# EAGLE design QuadControl2_itg-3200_2 (EAGLE 5.11)
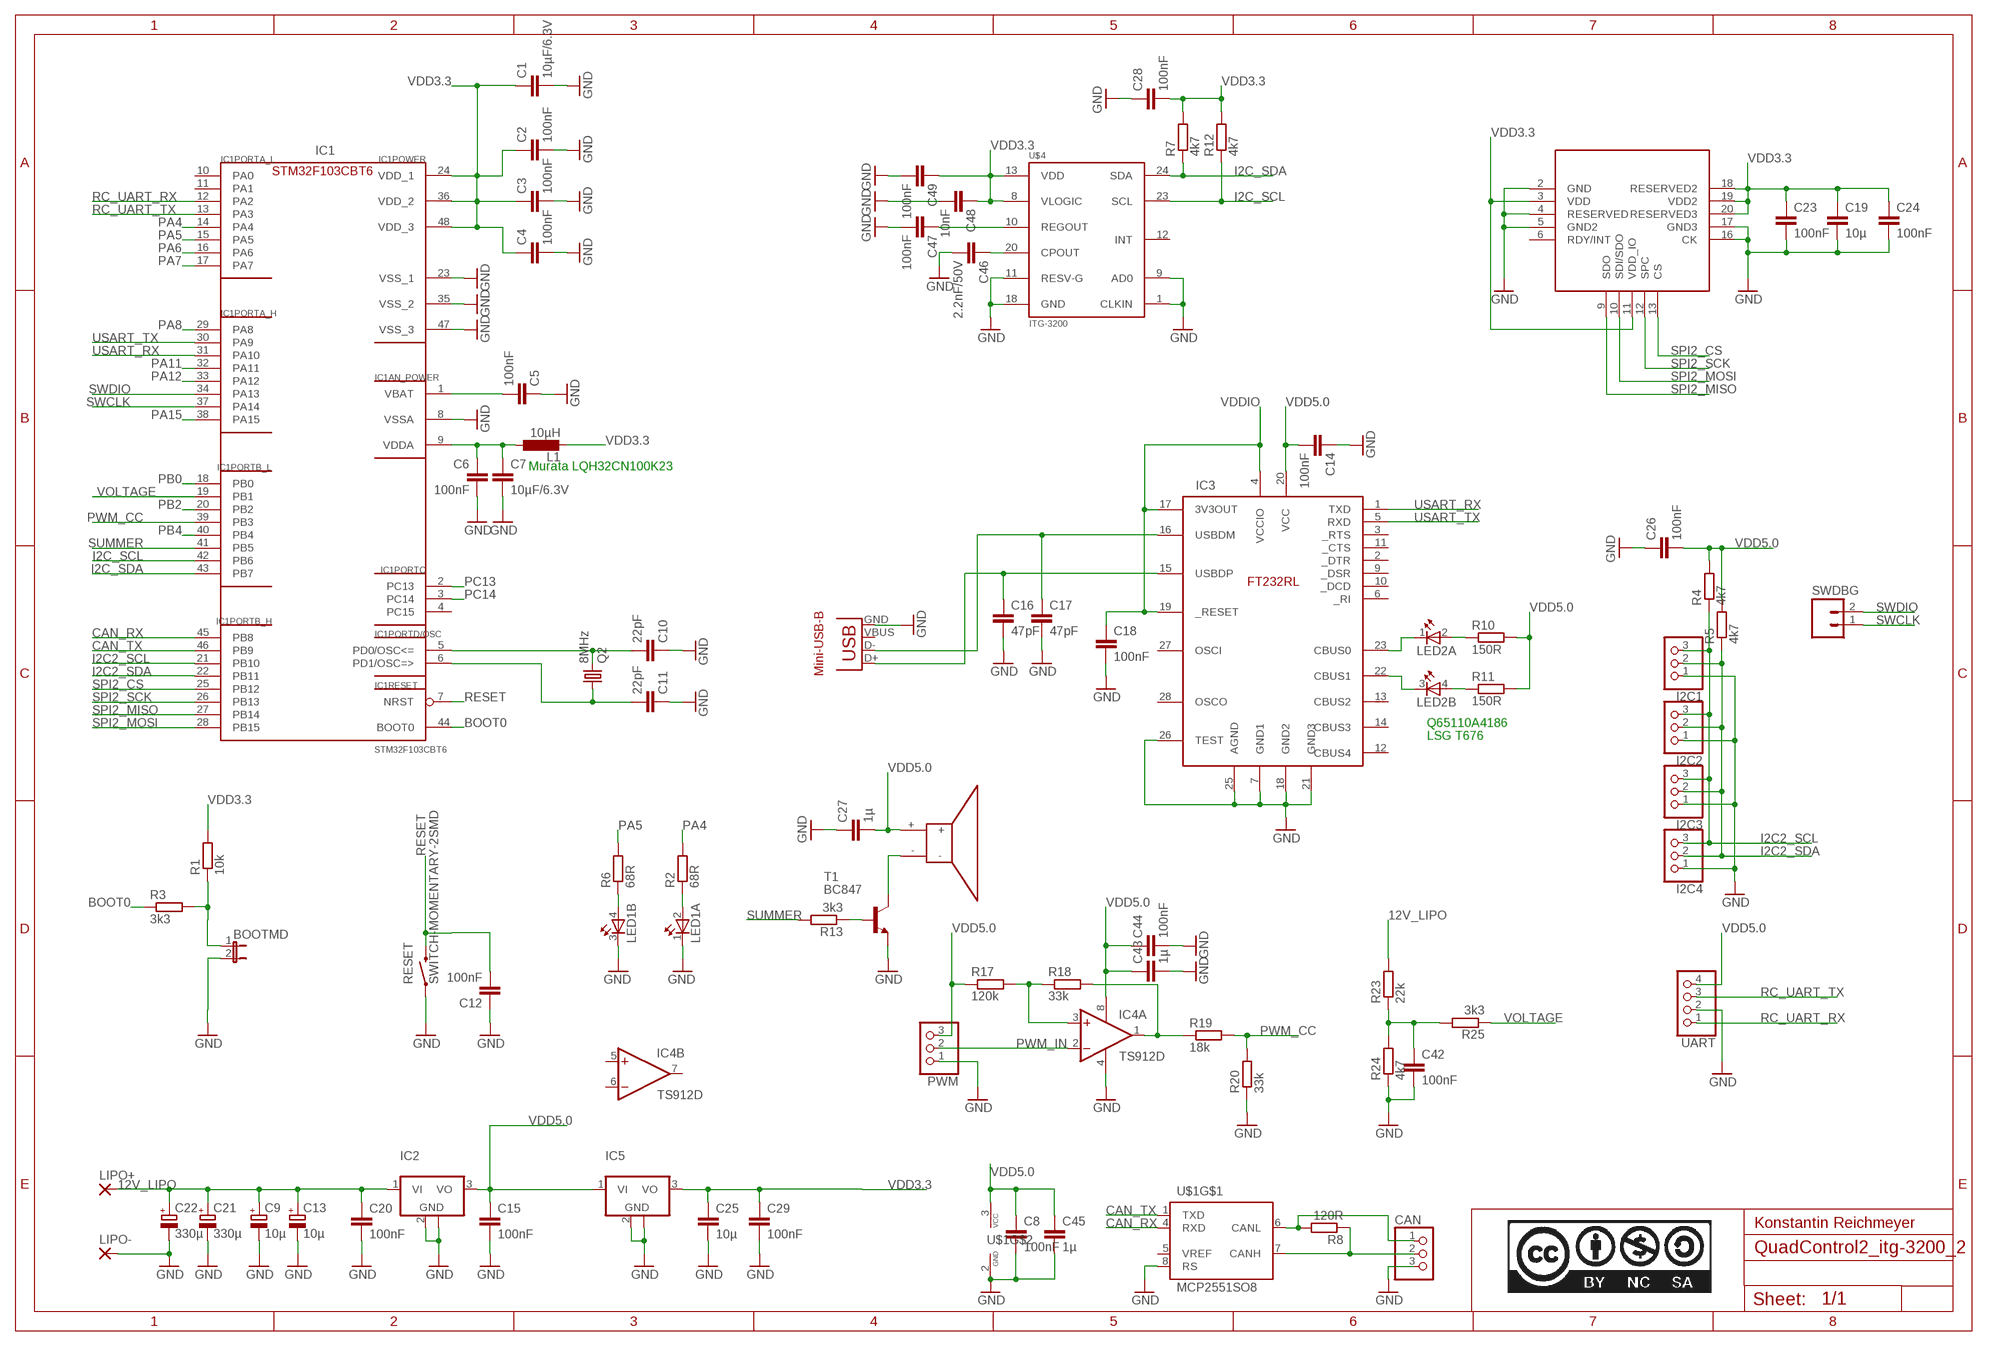
[diagram p0: schematic, sheet 1]

## Parts
BOOTMD  JUMPER-2PTH  [1X02]
C1  10µF/6.3V  C-EUC0805  [C0805]
C2  100nF  C-EUC0805  [C0805]
C3  100nF  C-EUC0805  [C0805]
C4  100nF  C-EUC0805  [C0805]
C5  100nF  C-EUC0805  [C0805]
C6  100nF  C-EUC0805  [C0805]
C7  10µF/6.3V  C-EUC0805  [C0805]
C8  100nF  C-EUC0805  [C0805]
C9  10µ  CPOL-EUD/7343-31R  [D/7343-31R]
C10  22pF  C-EUC0805  [C0805]
C11  22pF  C-EUC0805  [C0805]
C12  100nF  C-EUC0805  [C0805]
C13  10µ  CPOL-EUD/7343-31R  [D/7343-31R]
C14  100nF  C-EUC0805  [C0805]
C15  100nF  C-EUC0805  [C0805]
C16  47pF  C-EUC0805  [C0805]
C17  47pF  C-EUC0805  [C0805]
C18  100nF  C-EUC0805  [C0805]
C19  10µ  C-EUC0805  [C0805]
C20  100nF  C-EUC0805  [C0805]
C21  330µ  CPOL-EUF  [PANASONIC_F]
C22  330µ  CPOL-EUF  [PANASONIC_F]
C23  100nF  C-EUC0805  [C0805]
C24  100nF  C-EUC0805  [C0805]
C25  10µ  C-EUC0805  [C0805]
C26  100nF  C-EUC0805  [C0805]
C27  1µ  C-EUC0805  [C0805]
C28  100nF  C-EUC0805  [C0805]
C29  100nF  C-EUC0805  [C0805]
C42  100nF  C-EUC0805  [C0805]
C43  1µ  C-EUC0805  [C0805]
C44  100nF  C-EUC0805  [C0805]
C45  1µ  C-EUC0805  [C0805]
C46  2.2nF/50V  C-EUC0805  [C0805]
C47  100nF  C-EUC0805  [C0805]
C48  10nF  C-EUC0805  [C0805]
C49  100nF  C-EUC0805  [C0805]
CAN  PINHD-1X3  [1X03]
I2C1  PINHD-1X3  [1X03]
I2C2  PINHD-1X3  [1X03]
I2C3  PINHD-1X3  [1X03]
I2C4  PINHD-1X3  [1X03]
IC1  STM32F103CBT6  STM32F10XCXT6  [TQFP48]
IC2  UA78M05DCY  [SOT223]
IC3  FT232RL  [SSOP28DB]
IC4  TS912D  [SO08]
IC5  UA78M05DCY  [SOT223]
L1  10µH  L-EUL1210  [R1210]
LED1  TOPLED-2-MPI  [P-LCC-4-2-MPI]
LED2  TOPLED-2-MPI  [P-LCC-4-2-MPI]
LIPO+  WIREPAD3,17/1,3  [3,17/1,3]
LIPO-  WIREPAD3,17/1,3  [3,17/1,3]
PWM  PINHD-1X3  [1X03]
Q2  8MHz  CRYSTALSM49  [SM49]
R1  10k  R-EU_R0805  [R0805]
R2  68R  R-EU_R0805  [R0805]
R3  3k3  R-EU_R0805  [R0805]
R4  4k7  R-EU_R0805  [R0805]
R5  4k7  R-EU_R0805  [R0805]
R6  68R  R-EU_R0805  [R0805]
R7  4k7  R-EU_R0805  [R0805]
R8  120R  R-EU_R0805  [R0805]
R10  150R  R-EU_R0805  [R0805]
R11  150R  R-EU_R0805  [R0805]
R12  4k7  R-EU_R0805  [R0805]
R13  3k3  R-EU_R0805  [R0805]
R17  120k  R-EU_R0805  [R0805]
R18  33k  R-EU_R0805  [R0805]
R19  18k  R-EU_R0805  [R0805]
R20  33k  R-EU_R0805  [R0805]
R23  22k  R-EU_R0805  [R0805]
R24  4k7  R-EU_R0805  [R0805]
R25  3k3  R-EU_R0805  [R0805]
RESET  SWITCH-MOMENTARY-2SMD  [TACTILE_SWITCH_SMD]
SWDBG  M02PTH  [1X02]
T1  BC847  [SOT23]
U$1  MCP2551SO8  [SO08]
U$2  AIS325DQ_DEVICEHANDSOLDER  [QFN-28]
U$3  SUMMER_DIV  [SUMMER_FOOTPRINT]
U$4  ITG-3200  [QFN-24HANDSOLDER]
UART  PINHD-1X4  [1X04]
USB2  USB-MB-S2  [USB-MP-S2]

## Nets
12V_LIPO: C9.+ C13.+ C20.1 C21.+ C22.+ IC2.1(VI) LIPO+.1(P) R23.2
3243: T1.3(C) U$3.-
BOOT0: IC1.44(RESET:BOOT0) R3.1
CAN_RX: IC1.45(PORTB_H:PB8) U$1.4(RXD)
CAN_TX: IC1.46(PORTB_H:PB9) U$1.1(TXD)
D+: C16.1 IC3.15(USBDP) USB2.D+
D-: C17.1 IC3.16(USBDM) USB2.D-
GND: BOOTMD.2 C1.2 C2.2 C3.2 C4.2 C5.1 C6.2 C7.2 C8.2 C9.- C10.1 C11.1 C12.1 C13.- C14.1 C15.2 C16.2 C17.2 C18.2 C19.2 C20.2 C21.- C22.- C23.2 C24.2 C25.2 C26.1 C27.1 C28.1 C29.2 C42.2 C43.2 C44.2 C45.2 C46.2 C47.2 C48.2 C49.2 CAN.3 I2C1.1 I2C2.1 I2C3.1 I2C4.1 IC1.8(AN_POWER:VSSA) IC1.23(POWER:VSS_1) IC1.35(POWER:VSS_2) IC1.47(POWER:VSS_3) IC2.2(GND) IC2.4(GND) IC3.7(GND1) IC3.18(GND2) IC3.21(GND3) IC3.25(AGND) IC3.26(TEST) IC4.4(GND) IC5.2(GND) IC5.4(GND) LED1.1(A:C) LED1.3(B:C) LIPO-.1(P) PWM.1 R20.1 R24.1 RESET.1 T1.2(E) U$1.2(GND) U$1.8(RS) U$2.2(GND) U$2.4(RESERVED) U$2.5(GND2) U$2.16(CK) U$2.17(GND3) U$4.1(CLKIN) U$4.9(AD0) U$4.11(RESV-G) U$4.18(GND) UART.2 USB2.GND
I2C2_SCL: I2C1.3 I2C2.3 I2C3.3 I2C4.3 IC1.21(PORTB_H:PB10) R4.1
I2C2_SDA: I2C1.2 I2C2.2 I2C3.2 I2C4.2 IC1.22(PORTB_H:PB11) R5.1
I2C_SCL: IC1.42(PORTB_L:PB6) R12.1 U$4.23(SCL)
I2C_SDA: IC1.43(PORTB_L:PB7) R7.1 U$4.24(SDA)
N$1: CAN.1 R8.2 U$1.6(CANL)
N$2: IC3.23(CBUS0) LED2.1(A:C)
N$3: IC3.22(CBUS1) LED2.3(B:C)
N$4: LED2.2(A:A) R10.1
N$5: LED2.4(B:A) R11.1
N$6: C46.1 U$4.20(CPOUT)
N$7: CAN.2 R8.1 U$1.7(CANH)
N$8: LED1.2(A:A) R2.1
N$9: LED1.4(B:A) R6.1
N$10: BOOTMD.1 R1.1 R3.2
N$12: R13.1 T1.1(B)
N$13: C47.1 U$4.10(REGOUT)
N$18: C10.2 IC1.5(PORTD/OSC:PD0/OSC<=) Q2.2
N$19: C11.2 IC1.6(PORTD/OSC:PD1/OSC=>) Q2.1
N$22: C42.1 R23.1 R24.2 R25.2
N$24: IC4.3(A:+IN) R17.2 R18.1
N$25: IC4.1(A:OUT) R18.2 R19.1
PA4: IC1.14(PORTA_L:PA4) R2.2
PA5: IC1.15(PORTA_L:PA5) R6.2
PA6: IC1.16(PORTA_L:PA6)
PA7: IC1.17(PORTA_L:PA7)
PA8: IC1.29(PORTA_H:PA8)
PA11: IC1.32(PORTA_H:PA11)
PA12: IC1.33(PORTA_H:PA12)
PA15: IC1.38(PORTA_H:PA15)
PB0: IC1.18(PORTB_L:PB0)
PB2: IC1.20(PORTB_L:PB2)
PB4: IC1.40(PORTB_L:PB4)
PC13: IC1.2(PORTC:PC13)
PC14: IC1.3(PORTC:PC14)
PWM_CC: IC1.39(PORTB_L:PB3) R19.2 R20.2
PWM_IN: IC4.2(A:-IN) PWM.2
RC_UART_RX: IC1.12(PORTA_L:PA2) UART.1
RC_UART_TX: IC1.13(PORTA_L:PA3) UART.3
RESET: C12.2 IC1.7(RESET:NRST) RESET.3
SPI2_CS: IC1.25(PORTB_H:PB12) U$2.13(CS)
SPI2_MISO: IC1.27(PORTB_H:PB14) U$2.9(SDO)
SPI2_MOSI: IC1.28(PORTB_H:PB15) U$2.10(SDI/SDO)
SPI2_SCK: IC1.26(PORTB_H:PB13) U$2.12(SPC)
SUMMER: IC1.41(PORTB_L:PB5) R13.2
SWCLK: IC1.37(PORTA_H:PA14) SWDBG.1
SWDIO: IC1.34(PORTA_H:PA13) SWDBG.2
USART_RX: IC1.31(PORTA_H:PA10) IC3.1(TXD)
USART_TX: IC1.30(PORTA_H:PA9) IC3.5(RXD)
VBAT: C5.2 IC1.1(AN_POWER:VBAT)
VDD3.3: C1.1 C2.1 C3.1 C4.1 C19.1 C23.1 C24.1 C25.1 C28.2 C29.1 C48.1 C49.1 IC1.24(POWER:VDD_1) IC1.36(POWER:VDD_2) IC1.48(POWER:VDD_3) IC5.3(VO) L1.2 R1.2 R7.2 R12.2 U$2.3(VDD) U$2.11(VDD_IO) U$2.18(RESERVED2) U$2.19(VDD2) U$2.20(RESERVED3) U$4.8(VLOGIC) U$4.13(VDD)
VDD5.0: C8.1 C14.2 C15.1 C26.2 C27.2 C43.1 C44.1 C45.1 IC2.3(VO) IC3.20(VCC) IC4.8(+5V) IC5.1(VI) PWM.3 R4.2 R5.2 R10.2 R11.2 R17.1 U$1.3(VCC) U$3.+ UART.4
VDDA: C6.1 C7.1 IC1.9(AN_POWER:VDDA) L1.1
VDDIO: C18.1 IC3.4(VCCIO) IC3.17(3V3OUT) IC3.19(_RESET)
VOLTAGE: IC1.19(PORTB_L:PB1) R25.1
Unconnected: IC1.4(PORTC:PC15) IC1.10(PORTA_L:PA0) IC1.11(PORTA_L:PA1) IC3.2(_DTR) IC3.3(_RTS) IC3.6(_RI) IC3.9(_DSR) IC3.10(_DCD) IC3.11(_CTS) IC3.12(CBUS4) IC3.13(CBUS2) IC3.14(CBUS3) IC3.27(OSCI) IC3.28(OSCO) IC4.5(B:+IN) IC4.6(B:-IN) IC4.7(B:OUT) U$1.5(VREF) U$2.6(RDY/INT) U$4.12(INT) USB2.VBUS

## Notes on the sheet
- IC1
- STM32F103CBT6
- Murata LQH32CN100K23
- FT232RL
- Mini-USB-B
- Q65110A4186
- LSG T676
- Konstantin Reichmeyer

## Library data of the parts
BOOTMD = SparkFun:JUMPER-2: Jumper Basic 0.1" spaced jumper. Use with breakaway headers.
C1-C8 C10-C12 C14-C20 C23-C29 C42-C49 = rcl:C-EU: CAPACITOR, European symbol
C9 C13 C21 C22 = rcl:CPOL-EU: POLARIZED CAPACITOR, European symbol
CAN I2C1-I2C4 PWM = pinhead:PINHD-1X3: PIN HEADER
IC1 = stm32:STM32F10XCXT6: ST STM32F101/103 48pin LQFP
IC2 IC5 = linear:UA78M*: POSITIVE-VOLTAGE REGULATORS Source: http://focus.ti.com/lit/ds/symlink/ua78m33.pdf
IC3 = ftdichip:FT232RL: USB UART 4th Generation USB UART (USB <-> Serial) Controller
IC4 = ts912:TS912: OP AMP TS912 Rail-to-Rail OP AMP Source: http://www.st.com/stonline/products/literature/ds/2325/ts912.pdf
L1 = rcl:L-EU: INDUCTOR, European symbol
LED1 LED2 = led:TOPLED-2-: Multi TOPLED® (two color) LG T672, LP T672 LSY T67B LSW T67C LSY T675 LSY T676 LSG T677 LSG T770 Source: http://www.osram.convergy.de/
LIPO+ LIPO- = wirepad:WIREPAD: Wire PAD connect wire on PCB
Q2 = crystal:CRYSTAL: CRYSTAL
R1-R8 R10-R13 R17-R20 R23-R25 = rcl:R-EU_: RESISTOR, European symbol
RESET = SparkFun:SWITCH-MOMENTARY-2
SWDBG = SparkFun:M02: Header 2 Standard 2-pin 0.1" header. Use with straight break away headers (SKU : PRT-00116), right angle break away headers (PRT-00553), swiss pins (PRT-00743), machine pins (PRT-00117), and female headers (PRT-00115). Molex polarized connector foot print use with SKU : PRT-08233 with associated crimp pins and housings.
T1 = transistor:BC847: NPN TRANSISTOR
U$1 = can:MCP2551: CAN Tranceiver Microchip
U$2 = ais326dq:AIS325DQ_DEVICE
U$3 = summer:SUMMER_DIV
U$4 = SparkFun:ITG-3200: ITG-3200 3-axis gyro, digital output, qfn24 package
UART = pinhead:PINHD-1X4: PIN HEADER
USB2 = con-usb:USB: USB Connectors

## Board
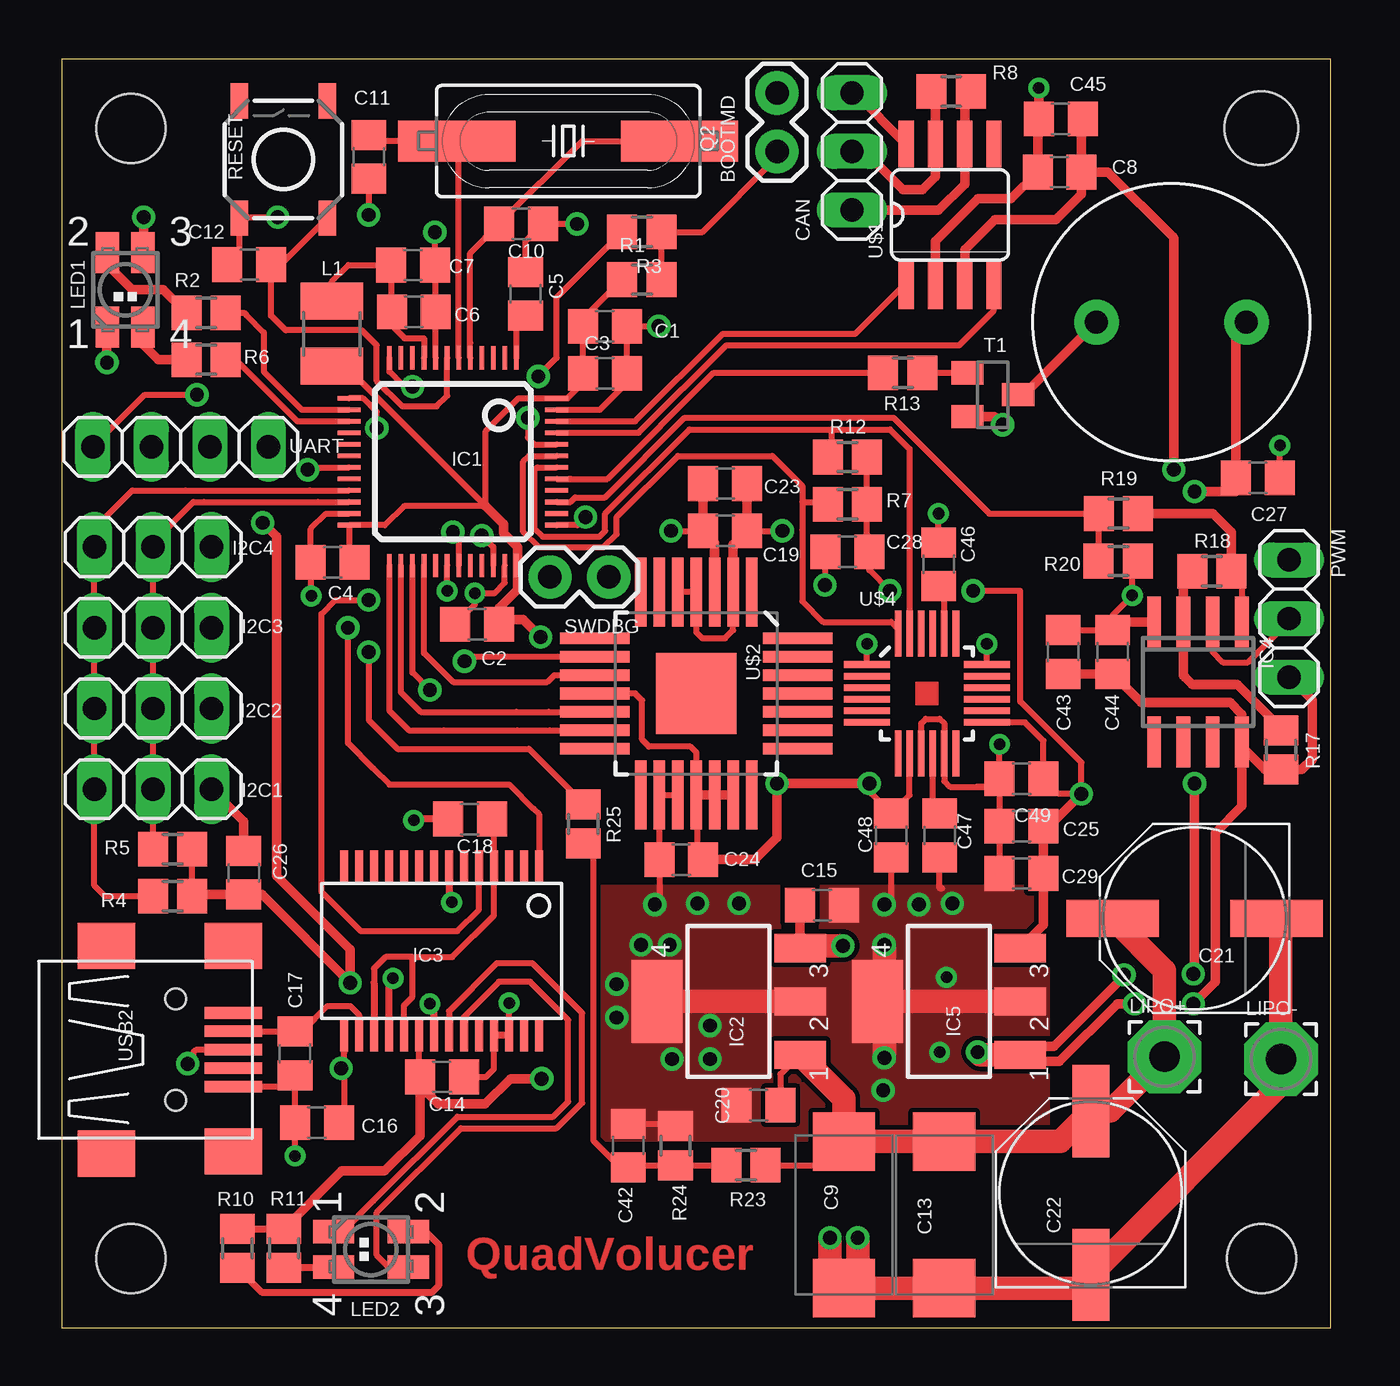
[diagram p1: board, top side]
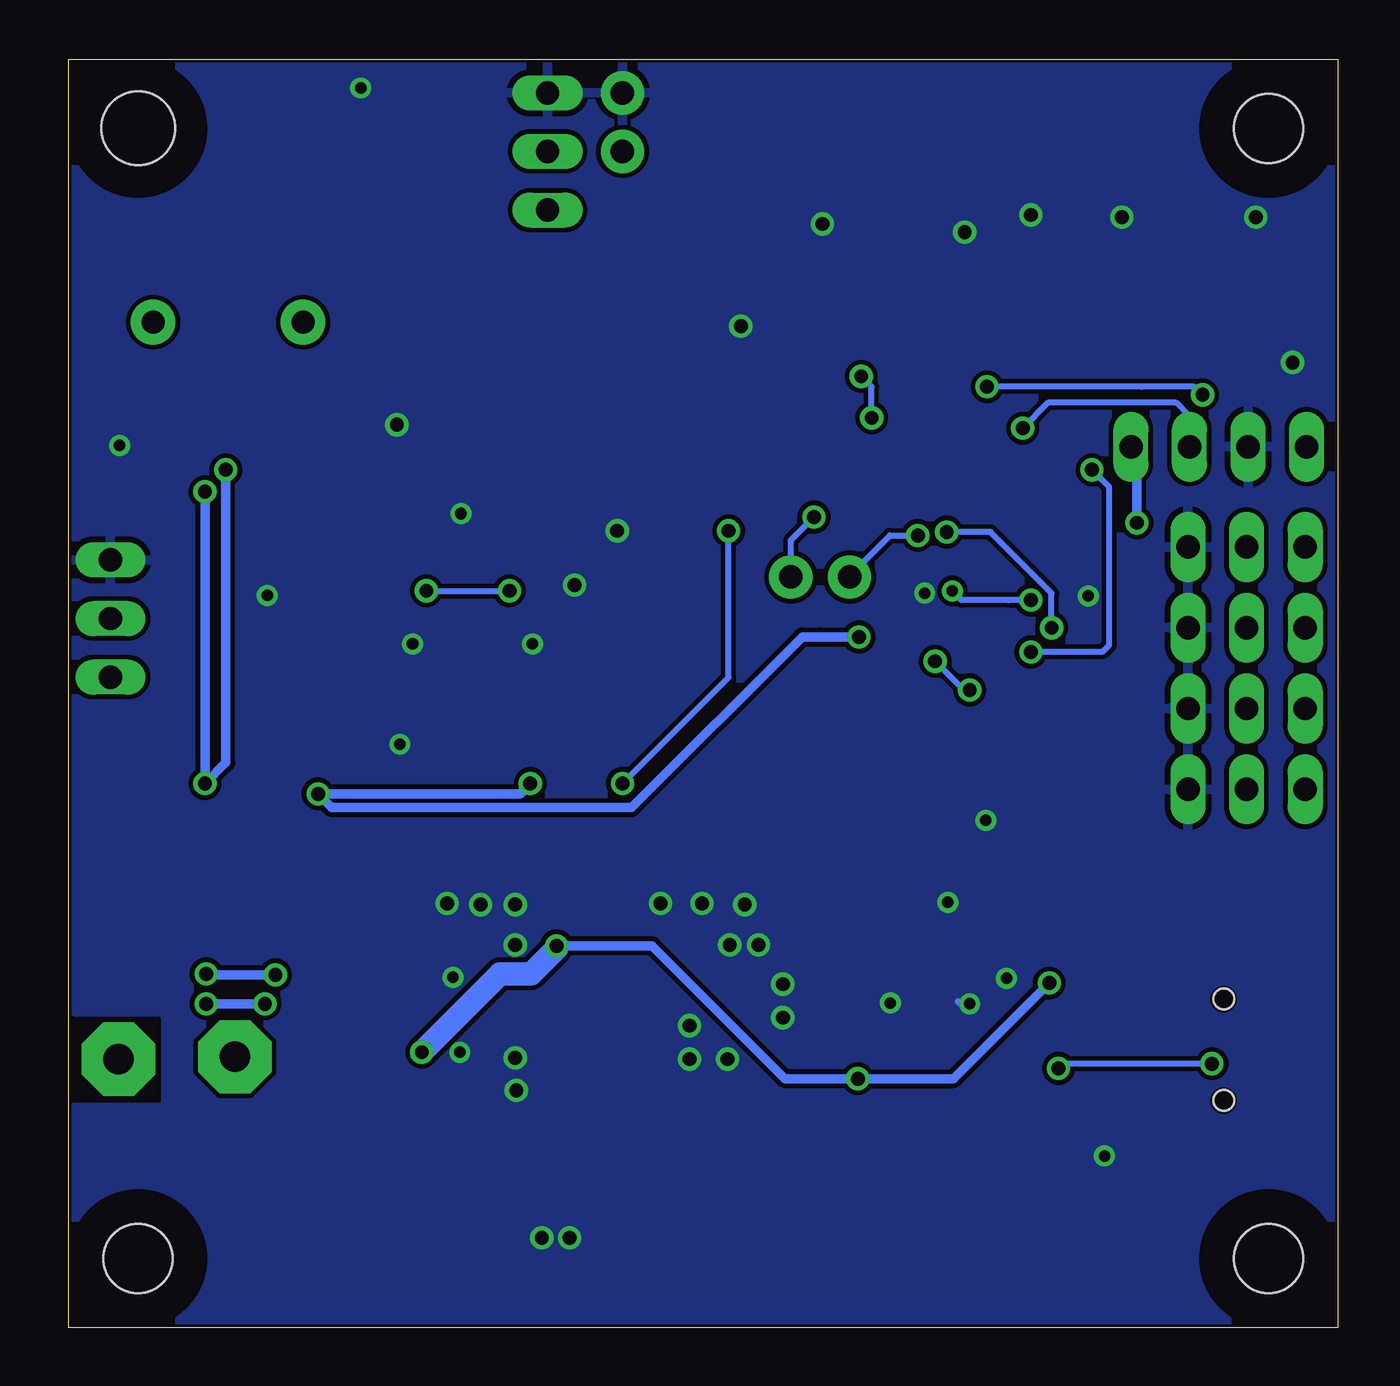
[diagram p2: board, bottom side, seen from below]

Size 55 x 55 mm. Coordinates in mm from the lower left corner, seen from the top.
Outline: 55,0 55,55 0,55 0,0 55,0
Copper layers (1*16): Top 0.035mm / dielectric 1.5mm / Bottom 0.035mm
Design rules: minimum track width 5mil, minimum drill 10mil, track to track 8mil, track to pad 8mil, pad to pad 8mil, via to via 8mil, smd to smd 8mil, copper to edge 5mil, drill to drill 8mil, minimum pad ring 10mil, minimum via ring 8mil, stop-mask expansion 4mil, vias tented up to drill 0mil, thermal gap 10mil
Holes 3 mm at 52,3 3,3 3,52
Holes 3.2 mm at 52,52
tRestrict: area 49,0 to 55,6; area 0,0 to 6,6; area 0,49 to 6,55; area 49,49 to 55,55
bRestrict: area 49,0 to 55,6; area 0,0 to 6,6; area 0,49 to 6,55; area 49,49 to 55,55

### Footprints (pad centres in the part's own frame; a part is rotated, then mirrored left to right if it is on the bottom)
1X02 = drill 1.016 pad 1.88: 1 0,0; 2 2.54,0
C0805 = smd 1.3 x 1.5: 1 -0.95,0; 2 0.95,0
D/7343-31R = smd 2.55 x 2.7: + 3.175,0; - -3.175,0
PANASONIC_F = smd 4 x 1.6: + 3.55,0; - -3.55,0
1X03 = drill 1.016 long: 1 -2.54,0; 2 0,0; 3 2.54,0
TQFP48 = smd 0.2 x 1: 1 -2.75,-4.5; 2 -2.25,-4.5; 3 -1.75,-4.5; 4 -1.25,-4.5; 5 -0.75,-4.5; 6 -0.25,-4.5; 7 0.25,-4.5; 8 0.75,-4.5; 9 1.25,-4.5; 10 1.75,-4.5; 11 2.25,-4.5; 12 2.75,-4.5; 25 2.75,4.5; 26 2.25,4.5; 27 1.75,4.5; 28 1.25,4.5; 29 0.75,4.5; 30 0.25,4.5; 31 -0.25,4.5; 32 -0.75,4.5; 33 -1.25,4.5; 34 -1.75,4.5; 35 -2.25,4.5; 36 -2.75,4.5 | smd 1 x 0.2: 13 4.5,-2.75; 14 4.5,-2.25; 15 4.5,-1.75; 16 4.5,-1.25; 17 4.5,-0.75; 18 4.5,-0.25; 19 4.5,0.25; 20 4.5,0.75; 21 4.5,1.25; 22 4.5,1.75; 23 4.5,2.25; 24 4.5,2.75; 37 -4.5,2.75; 38 -4.5,2.25; 39 -4.5,1.75; 40 -4.5,1.25; 41 -4.5,0.75; 42 -4.5,0.25; 43 -4.5,-0.25; 44 -4.5,-0.75; 45 -4.5,-1.25; 46 -4.5,-1.75; 47 -4.5,-2.25; 48 -4.5,-2.75
SOT223 = smd 1.219 x 2.235: 1 -2.311,-3.099; 2 0,-3.099; 3 2.311,-3.099 | smd 3.6 x 2.2: 4 0,3.099
SSOP28DB = smd 0.348 x 1.397: 1 -4.225,-3.656; 2 -3.575,-3.656; 3 -2.925,-3.656; 4 -2.275,-3.656; 5 -1.625,-3.656; 6 -0.975,-3.656; 7 -0.325,-3.656; 8 0.325,-3.656; 9 0.975,-3.656; 10 1.625,-3.656; 11 2.275,-3.656; 12 2.925,-3.656; 13 3.575,-3.656; 14 4.225,-3.656; 15 4.225,3.656; 16 3.575,3.656; 17 2.925,3.656; 18 2.275,3.656; 19 1.625,3.656; 20 0.975,3.656; 21 0.325,3.656; 22 -0.325,3.656; 23 -0.975,3.656; 24 -1.625,3.656; 25 -2.275,3.656; 26 -2.925,3.656; 27 -3.575,3.656; 28 -4.225,3.656
SO08 = smd 0.6 x 2.2: 1 -1.905,-2.6; 2 -0.635,-2.6; 3 0.635,-2.6; 4 1.905,-2.6; 5 1.905,2.6; 6 0.635,2.6; 7 -0.635,2.6; 8 -1.905,2.6
R1210 = smd 1.6 x 2.7: 1 -1.4,0; 2 1.4,0
P-LCC-4-2-MPI = smd 1.016 x 1.778: 1 -0.77,-1.619; 2 -0.77,1.619; 3 0.77,1.619; 4 0.77,-1.619
3,17/1,3 = drill 1.321 pad 3.175 octagon: 1 0,0
SM49 = smd 5.08 x 1.778: 1 -4.826,0; 2 4.826,0
R0805 = smd 1.3 x 1.5: 1 -0.85,0; 2 0.85,0
TACTILE_SWITCH_SMD = smd 1.524 x 0.762: 1 -2.54,1.905; 2 2.54,1.905; 3 -2.54,-1.905; 4 2.54,-1.905
SOT23 = smd 1 x 1.4: 1 -0.95,-1.1; 2 0.95,-1.1; 3 0,1.1
SO08' = smd 0.66 x 2.032: 1 -1.905,-3.073; 2 -0.635,-3.073; 3 0.635,-3.073; 4 1.905,-3.073; 5 1.905,3.073; 6 0.635,3.073; 7 -0.635,3.073; 8 -1.905,3.073
QFN-28 = smd 3.5 x 3.5: 0 0,0 | smd 3 x 0.5: 1 -4.4,2.4; 2 -4.4,1.6; 3 -4.4,0.8; 4 -4.4,0; 5 -4.4,-0.8; 6 -4.4,-1.6; 7 -4.4,-2.4; 15 4.4,-2.4; 16 4.4,-1.6; 17 4.4,-0.8; 18 4.4,0; 19 4.4,0.8; 20 4.4,1.6; 21 4.4,2.4 | smd 0.5 x 3: 8 -2.4,-4.4; 9 -1.6,-4.4; 10 -0.8,-4.4; 11 0,-4.4; 12 0.8,-4.4; 13 1.6,-4.4; 14 2.4,-4.4; 22 2.4,4.4; 23 1.6,4.4; 24 0.8,4.4; 25 0,4.4; 26 -0.8,4.4; 27 -1.6,4.4; 28 -2.4,4.4
SUMMER_FOOTPRINT = drill 1 pad 1.93: + -3,0; - 3.5,0
QFN-24HANDSOLDER = smd 2 x 0.295: 1 -2.6,1.25; 2 -2.6,0.75; 3 -2.6,0.25; 4 -2.6,-0.25; 5 -2.6,-0.75; 6 -2.6,-1.25; 13 2.6,-1.25; 14 2.6,-0.75; 15 2.6,-0.25; 16 2.6,0.25; 17 2.6,0.75; 18 2.6,1.25 | smd 0.295 x 2: 7 -1.25,-2.6; 8 -0.75,-2.6; 9 -0.25,-2.6; 10 0.25,-2.6; 11 0.75,-2.6; 12 1.25,-2.6; 19 1.25,2.6; 20 0.75,2.6; 21 0.25,2.6; 22 -0.25,2.6; 23 -0.75,2.6; 24 -1.25,2.6
1X04 = drill 1.016 long: 1 -3.81,0; 2 -1.27,0; 3 1.27,0; 4 3.81,0
USB-MP-S2 = smd 2.5 x 0.5: D+ 2.487,0.005; D- 2.487,0.805; GND 2.487,-1.595; ID 2.487,-0.795; VBUS 2.487,1.605 | smd 2.5 x 2: P$1 -3.013,-4.495; P$2 -3.013,4.505; P$3 2.487,-4.395; P$4 2.487,4.505 | hole 0.9: -0.013,2.205; -0.013,-2.195

### Placement (x,y rotation side)
BOOTMD  31,51 90 top
C1  23.54,43.42 0 top
C2  18,30.5 180 top
C3  23.54,41.37 0 top
C4  11.74,33.18 180 top
C5  20.1,44.82 270 top
C6  15.26,44.05 0 top
C7  15.22,46.07 0 top
C8  43.25,50.1 180 top
C9  33.9,4.9 90 top
C10  19.91,47.86 180 top
C11  13.31,50.76 90 top
C12  8.12,46.09 0 top
C13  38.25,4.9 90 top
C14  16.48,10.88 180 top
C15  32.95,18.32 0 top
C16  11.06,8.89 180 top
C17  10.11,11.9 270 top
C18  17.69,22.06 180 top
C19  28.75,34.55 0 top
C20  30.2,9.65 180 top
C21  49.1,17.75 180 top
C22  44.6,5.85 90 top
C23  28.75,36.6 0 top
C24  26.85,20.3 180 top
C25  41.6,21.75 180 top
C26  7.88,19.73 270 top
C27  51.85,36.85 180 top
C28  34.05,33.65 0 top
C29  41.6,19.7 180 top
C42  24.55,7.9 90 top
C43  43.4,29.3 90 top
C44  45.55,29.3 90 top
C45  43.3,52.4 180 top
C46  38,33.1 90 top
C47  38.05,21.35 270 top
C48  35.95,21.35 270 top
C49  41.6,23.8 180 top
CAN  34.25,51 90 top
I2C1  3.95,23.35 180 top
I2C2  3.95,26.85 180 top
I2C3  3.95,30.35 180 top
I2C4  3.95,33.85 180 top
IC1  16.95,37.55 180 top
IC2  28.9,14.15 90 top
IC3  16.45,16.35 180 top
IC4  49.25,28 180 top
IC5  38.45,14.15 90 top
L1  11.7,43.1 270 top
LED1  2.75,45 0 top
LED2  13.4,3.4 270 top
LIPO+  47.8,11.75 0 top
LIPO-  52.85,11.65 0 top
PWM  53.2,30.75 270 top
Q2  21.95,51.45 0 top
R1  25.14,45.44 180 top
R2  6.25,44 0 top
R3  25.14,47.51 0 top
R4  4.8,18.72 0 top
R5  4.8,20.75 0 top
R6  6.25,41.97 0 top
R7  34.05,35.7 0 top
R8  38.55,53.6 0 top
R10  7.61,3.45 90 top
R11  9.63,3.45 90 top
R12  34.05,37.75 0 top
R13  36.45,41.4 180 top
R17  52.85,25.05 90 top
R18  49.85,32.8 0 top
R19  45.8,35.3 180 top
R20  45.79,33.24 180 top
R23  29.65,7.05 0 top
R24  26.6,7.9 270 top
R25  22.6,21.85 270 top
RESET  9.6,50.65 90 top
SWDBG  23.7,32.55 180 top
T1  40.35,40.45 270 top
U$1  MCP2551SO8  [SO08']  38.5,48.25 0 top
U$2  27.5,27.5 270 top
U$3  48.35,43.6 180 top
U$4  37.5,27.5 0 top
UART  5.15,38.2 0 top
USB2  4.95,12.05 0 top

### Tracks (layer width: path | path; a pad name or v marks a point on that pad's centre or on a via)
12V_LIPO
  Top 0.254: C9.+ 33.62,8.07 32.6,7.05 R23.2 | C20.1 31.15,10.99 IC2.1
  Top 1.016: 31.95,11.84 IC2.1 33.9,9.94 C9.+ C13.+ 43.27,8.07 C22.+ 45.45,9.4 LIPO+.1 47.8,15.5 C21.+
3243
  Top 0.406: U$3.- 41.7,40.45 T1.3
BOOT0  (via drill 0.6, 0.6 pad 0.25)
  Top 0.254: IC1.44 20.5,38.3 20.2,38.6 v20.2,39.45 | R3.1 21.45,44.67 21.45,42.05 v20.65,41.25
  Bottom 0.254: v20.2,39.45 20.2,40.8 v20.65,41.25
CAN_RX
  Top 0.254: IC1.45 25,38.8 28.8,42.6 38.9,42.6 40.4,44.1 U$1.4
CAN_TX
  Top 0.254: IC1.46 24.85,39.3 28.65,43.1 34.4,43.1 36.48,45.18 U$1.1 | 36.6,45.2 36.6,45.15
  Top 0.406: 36.6,45.2 36.59,45.2 U$1.1
D+  (via drill 0.6)
  Top 0.254: C16.1 12.22,9.11 12.22,11.25 | 12.22,11.25 IC3.15 12.22,11.9 | USB2.D+ 5.8,12.05 5.7,11.95 5.7,11.7 v5.45,11.45 | v12.1,11.25 12.22,11.25
  Bottom 0.254: v12.1,11.25 11.9,11.45 v5.45,11.45
D-
  Top 0.254: IC3.16 12.88,13.57 12.5,13.95 11.5,13.95 10.45,12.9 10.16,12.9 C17.1 7.53,12.85 7.48,12.9
  Top 0.305: USB2.D- 7.48,12.9
GND  (via drill 0.5, 0.5 pad 0.25, 0.6, 0.6 pad 0.25)
  Top 0.254: U$4.9 37.25,26.2 37.45,26.4 38.05,26.4 38.25,26.2 U$4.11 38.25,23.7 38.5,23.45 40.65,23.45 | U$4.1 v34.9,29.65 | U$4.18 v40.1,29.65 | v9.35,48.15 7.74,48.15 RESET.1 7.7,46.62 C12.1 | IC1.23 11.45,35.3 10.79,34.64 C4.2 10.81,33.16 v10.81,31.73 | IC1.35 19.2,32.3 18.75,31.85 v17.9,31.85 17.9,31.35 C2.2 | IC3.25 18.73,11.22 18.38,10.88 C14.1 | v19.39,14.08 19.39,12.71 IC3.26 | USB2.GND 9.66,10.46 10.11,10.9 C17.2 C16.2 v10.11,7.45 | v25.87,43.42 C1.2 C3.2 24.49,40.97 23.32,39.8 IC1.47 | C10.1 v22.33,47.86 | C11.1 v13.31,48.26 v13.3,48.25 | v16.17,47.5 C7.2 16.17,45.97 16.21,45.93 C6.2 IC1.8 | C46.2 v38,35.3 | C19.2 v31.23,34.55 | C42.2 26.95,8.85 | U$2.17 U$2.16 25.9,20.4 | U$2.5 U$2.4 27.5,30.15 27.75,29.9 28.75,29.9 29.1,30.25 U$2.2 | C24.2 25.9,20.4 | C10.1 | C5.1 20.1,47.1 C10.1 | 40.65,23.45 C49.2 v40.65,25.3 | 40.65,23.45 39.65,23.45 | C20.2 29.35,9.75 | 25.9,20.4 25.9,18.55 v25.7,18.35 | C48.2 35.95,19.15 35.95,18.65 v35.65,18.35 | C47.2 38.05,19.05 38.15,19.05 | 40.65,23.45 40.65,21.8 | 40.65,21.8 C25.2 | R20.1 46.4,33 v46.4,31.75 45.55,30.9 C44.2 C43.2 | C27.1 v52.8,38.25 | C28.1 33.1,32.22 v33.08,32.2 | 40.65,21.8 40.65,19.9 40.75,19.8
  Top 0.305: IC3.25 IC3.26 | IC3.7 16.77,18.57 v16.9,18.45 | IC3.18 14.18,14.97 v14.35,15.15 | C18.2 15.31,22.06 v15.25,22 | v15.95,14.05 16.12,13.88 IC3.21
  Top 0.406: v42.35,53.75 C45.2 42.3,52.35 C8.2 41.15,48.95 39.7,48.95 37.87,47.12 U$1.2 | C23.2 C19.2 29.1,33.95 U$2.2 | U$1.8 34.38,53.54 CAN.3 | T1.2 40.43,39.5 v40.78,39.15 | I2C1.1 7.88,21.96 C26.1 | IC4.4 47.2,30.6 45.9,30.6 C44.2 | C15.2 33.95,18.37 | LED1.1 1.95,43.35 v1.95,41.85 | LED1.3 3.55,46.65 v3.55,48.15
  Top 1.016: C21.- 52.85,17.55 52.85,12.15 | 52.85,12.15 LIPO-.1 | 52.85,12.15 52.85,10.55 C22.- 44.02,1.73 C13.- 34.4,1.73 C9.- 34.1,1.93 34.5,1.93 v34.5,3.9 | IC2.4 IC2.2 | IC5.2 IC5.4 35.65,14.45 v35.65,16.6 | v35.65,11.7 35.65,13.95 35.6,14 | v33.3,3.9 33.3,2.4 33.95,1.75
  Bottom 0.305: 16.45,14.15 16.25,13.95
  other vias: 38.35,15.2 38.05,11.95 26.35,16.6 25.1,16.6 28.1,11.65 24.05,14.9 28.1,13.1 27.55,18.4 35.6,10.3 38.6,18.4 37.15,18.35 29.35,18.4 24.05,13.45 26.45,11.65
  pour Bottom: 0.2,0.2 0.2,54.8 54.8,54.8 54.75,13.7 50.95,13.7 50.95,13.65 50.8,13.65 50.8,9.55 54.8,9.55 54.8,0.2
  pour Top (no thermals): 23.4,8.2 23.4,19.1 42.7,19.1 42.7,8.2
I2C2_SCL
  Top 0.254: IC1.21 10.75,36.3 5.35,36.3 3.05,36.3 1.41,34.66 1.41,34.46 I2C4.3 I2C3.3 I2C2.3 I2C1.3 1.41,19.17 1.86,18.72 R4.1
I2C2_SDA
  Top 0.254: IC1.22 11.1,35.8 6.15,35.8 5.7,35.8 3.95,34.05 I2C4.2 I2C3.2 I2C2.2 I2C1.2 3.95,22.15 R5.1
I2C_SCL
  Top 0.254: IC1.42 20.6,37.3 20.5,37.2 20.5,34.65 20.85,34.3 23.3,34.3 23.55,34.55 23.55,35.3 27.2,38.95 33.35,38.95 | 33.35,38.95 35.9,38.95 36.75,38.1 U$4.23 | R12.1 33.35,37.9 33.35,38.95
I2C_SDA
  Top 0.254: IC1.43 20.25,37.8 20,37.55 20,34.5 20.66,33.84 23.49,33.84 24.05,34.4 24.05,35.15 26.7,37.8 30.8,37.8 32.1,36.5 32.1,35.8 | U$4.24 36.25,30.3 35.95,30.6 33,30.6 32.1,31.5 32.1,34.6 32.1,35.8 | R7.1 33.1,35.8 32.1,35.8
N$1
  Top 0.406: CAN.1 38,48.45 39.13,49.59 U$1.6 39.13,53.69 39.22,53.6 R8.2
N$2
  Top 0.254: IC3.23 17.43,13.47 18.95,15 20.3,15 21.95,13.35 21.95,9.8 21.3,9.15 17.15,9.15 13.5,5.5 12.17,4.17 LED2.1
N$3
  Top 0.254: 14.17,2.63 13.65,3.15 13.65,5 17.3,8.65 21.45,8.65 22.55,9.75 22.55,13.65 20.4,15.8 18.85,15.8 16.77,13.72 IC3.22
  Top 0.305: LED2.3 14.17,2.63
N$4
  Top 0.305: LED2.2 15.78,4.17 16.35,3.6 16.35,1.85 16.05,1.55 8.66,1.55 R10.1
N$5
  Top 0.305: LED2.4 9.66,2.63 R11.1
N$6
  Top 0.254: C46.1 38.25,31.9 U$4.20
N$7
  Top 0.406: CAN.2 34.8,51 36.45,49.35 37.3,49.35 37.87,49.91 U$1.7 37.87,53.6 | 37.87,53.6 37.87,53.78 | 37.87,53.6 R8.1
N$8
  Top 0.406: R2.1 4.4,45 3.05,45 1.98,46.07 LED1.2
N$9
  Top 0.406: R6.1 4.18,41.97 3.52,42.63 LED1.4
N$10
  Top 0.254: BOOTMD.1 31,50.75 27.76,47.51 R3.2 R1.1
N$12
  Top 0.254: R13.1 T1.1
N$13
  Top 0.254: U$4.10 37.75,22.6 C47.1
N$18
  Top 0.254: 17.7,42.7 IC1.5 17.7,46.6 C10.2 22.55,51.45 Q2.2
N$19
  Top 0.254: Q2.1 17.21,51.36 | Q2.1 13.57,51.45 C11.2 | IC1.6 17.2,51.37 Q2.1
N$22
  Top 0.254: 25.1,7.05 R24.2 R23.1 | C42.1 24.2,6.95 23.05,8.1 23.05,20.55 R25.2
  Top 0.406: C42.1 25,6.95 25.1,7.05
N$24
  Top 0.406: R17.2 52.85,26 50.95,27.9 50.75,27.9 49,27.9 48.7,28.2 48.62,28.29 IC4.3 48.62,32.41 R18.1
N$25
  Top 0.254: R18.2 51.16,32.34 IC4.1
  Top 0.406: R18.2 50.7,34.5 49.9,35.3 R19.1
PA4
  Top 0.254: IC1.14 10.4,39.8 8.75,41.45 8.75,43.15 8,43.9 7.9,44 R2.2
PA5
  Top 0.254: R6.2 7.53,41.97 10.2,39.3 IC1.15
PWM_CC
  Top 0.254: IC1.39 22.05,35.8 22.25,36 23.55,36 27,39.45 36.05,39.45 40.2,35.3 R19.2 R20.2
PWM_IN
  Top 0.254: PWM.2 53.2,30.65 51.4,28.85 50.34,28.85 49.88,29.3 IC4.2
RC_UART_RX  (via drill 0.6)
  Top 0.254: UART.1 3.59,40.45 v5.85,40.45 | IC1.12 14.2,41.45 14.75,40.9 15.1,40.9 v15.2,40.8
  Bottom 0.254: v15.2,40.8 8.5,40.8 6.2,40.8 v5.85,40.45
RC_UART_TX  (via drill 0.6)
  Top 0.254: IC1.13 13.05,40.3 13.65,39.7 v13.65,39
  Bottom 0.254: v13.65,39 12.55,40.1 7,40.1 6.42,39.52 UART.3
RESET
  Top 0.254: RESET.3 9.48,46.09 C12.2 9.07,43.88 9.7,43.25 13,43.25 13.65,42.6 13.65,41.05 14.75,39.95 16.25,39.95 16.7,40.4 IC1.7
SPI2_CS
  Top 0.254: IC1.25 14.2,26.75 15.05,25.9 16.55,25.9 19.75,25.9 21.15,25.9 U$2.13
SPI2_MISO  (via drill 0.6, 0.6 pad 0.25)
  Top 0.254: v15.95,27.65 15.2,28.4 IC1.27 | v17.45,28.9 17.65,29.1 U$2.9
  Bottom 0.254: v15.95,27.65 16.2,27.65 v17.45,28.9
SPI2_MOSI
  Top 0.254: U$2.10 21.35,28.3 21.05,28 16.95,28 15.7,29.25 IC1.28
SPI2_SCK
  Top 0.254: IC1.26 14.7,27.55 15.55,26.7 19.7,26.7 21.1,26.7 U$2.12
SUMMER
  Top 0.254: IC1.41 22,36.8 | 22,36.8 22.05,36.8 | 22,36.8 23.65,36.8 28.25,41.4 R13.2
SWCLK  (via drill 0.6)
  Top 0.254: IC1.37 22.35,34.8 v22.7,35.15
  Bottom 0.254: SWDBG.1 23.7,34.15 v22.7,35.15
SWDIO  (via drill 0.6)
  Top 0.254: IC1.34 18.7,33.85 v18.2,34.35
  Bottom 0.254: v18.2,34.35 19.41,34.35 21.16,32.6 SWDBG.2
USART_RX  (via drill 0.6 pad 0.25)
  Top 0.254: IC3.1 20.68,22.27 20.45,22.5 19.4,23.55 19.1,23.55 14.2,23.55 13.5,24.25 12.4,25.35 v12.4,30.35 | v16.95,34.5 17.2,34.25 IC1.31
  Bottom 0.254: v12.4,30.35 12.4,31.85 15,34.45 15.05,34.5 v16.95,34.5
USART_TX  (via drill 0.5 pad 0.25, 0.6 pad 0.25)
  Top 0.254: IC3.5 18.07,18.12 17.15,17.2 12.95,17.2 11.25,18.9 11.25,30.95 11.85,31.55 v13.3,31.55 | v16.7,31.95 IC1.30
  Bottom 0.254: v13.3,31.55 13.8,31.55 | 13.8,31.55 14.25,31.55 | v16.7,31.95 16.3,31.55 13.8,31.55
VBAT
  Top 0.254: IC1.1 19.7,43.47 C5.2
VDD3.3  (via drill 0.6, 0.6 pad 0.25)
  Top 0.254: L1.2 12.3,41.7 18.38,35.62 | C4.1 arc-90 12.45,33.42 IC1.24 14,34.8 14.82,35.62 18.38,35.62 | C2.1 19.05,30.5 | U$4.13 41.75,26.25 42.55,25.45 C49.1 43.2,23.15 v44.2,23.15 44.2,24.5 41.55,27.15 41.55,31.95 v39.5,31.95 | v35,23.6 35,23.25 C48.1 36.75,23.1 U$4.8 | U$2.11 24.85,27.5 25.15,27.2 25.15,25.5 25.45,25.2 27.25,25.2 27.5,24.95 U$2.18 | 19.7,33.9 IC1.36 | 27.55,23.1 27.55,20.55 C24.1 | v26.4,34.55 C19.1 | 18.38,35.62 18.38,38.88 19.8,40.3 IC1.48 21.92,40.3 22.59,40.97 C3.1 C1.1 22.59,43.74 R1.2 | R12.2 R7.2 34.9,34.4 34.9,33.75 C28.2 35,32.85 v35.9,31.95
  Top 0.406: U$2.18 27.55,23.1 U$2.19 U$2.20 | C23.1 C19.1 28.3,34.05 U$2.3 | v35,23.6 v31,23.6 31,21.25 30.05,20.3 C24.1 | 18.38,35.62 19.15,34.85 19.15,34.45 19.7,33.9 19.75,33.85 19.75,32 18.95,31.2 18.95,30.7 | 18.95,30.7 C2.1 | 18.95,30.7 20,30.7 v20.75,29.95 | v44.2,23.15 42.8,21.75 | 42.8,21.75 C25.1 | 42.8,21.75 42.55,21.5 C29.1 42.55,17.46 IC5.3
  Bottom 0.254: v26.4,34.55 26.4,28.2 v31,23.6 | v39.5,31.95 v35.9,31.95
  Bottom 0.406: v35,23.6 35.45,23.15 v44.2,23.15 43.6,22.55 30.6,22.55 23.2,29.95 22.45,29.95 v20.75,29.95
VDD5.0  (via drill 0.6, 0.6 pad 0.25)
  Top 0.254: IC3.20 15.47,10.88 15.48,10.88 C14.2 15.53,10.57 15.48,10.52 | R4.2 R5.2
  Top 0.305: R10.2 R11.2
  Top 0.406: 15.48,10.52 16.3,9.7 18.35,9.7 19.45,10.8 v20.8,10.8 | U$1.3 39.13,46.73 40.45,48.05 43.1,48.05 44.2,49.15 C8.1 | C43.1 C44.1 46.8,27.1 50.65,27.1 51.16,26.59 IC4.8 | C45.1 44.2,52.35 44.2,50.3 C8.1 | v8.7,34.9 9.3,34.3 9.3,19.6 12.5,16.4 v12.5,14.95 8.67,18.78 C26.2 5.71,18.78 R4.2 | C15.1 IC2.3 | PWM.3 54.2,27.21 54.2,24.65 53.75,24.2 R17.1 52.16,24.2 51.24,25.11 51.24,25.31 IC4.8 | IC4.8 51.16,22.61 50,21.46 50,16.45 50,15 v49.05,14.05 | v49.1,36.25 50.9,36.25 50.9,36.65 C27.2 50.9,43.15 U$3.+ | v48.2,37.2 48.2,47.25 48.15,47.3 45.35,50.1 C8.1 | v46.5,14.05 45.75,14.05 43.25,11.55 41.84,11.55 IC5.1 41.91,12.2 43,12.2 46.05,15.25 v46.05,15.3 | v49.1,23.6 49.1,15.4 v49.05,15.35 | R11.2 12.13,6.8 14,6.8 15.53,8.33 C14.2
  Top 1.016: IC2.3 32.1,16.56 v33.86,16.56 | IC5.1 39.81,11.84 v39.7,11.95
  Bottom 0.406: v12.5,14.95 16.65,10.8 v20.8,10.8 23.95,10.8 29.71,16.56 v33.86,16.56 | v8.7,34.9 8.7,37.94 UART.4 | v49.1,36.25 v49.1,23.6 48.2,24.5 v48.2,37.2 | v49.05,15.35 49,15.3 46.55,15.3 v46.05,15.3 | v49.05,14.05 48.4,14.05 v46.5,14.05
  Bottom 1.016: v39.7,11.95 36.3,15.35 34.97,15.35 33.86,16.46 v33.86,16.56
VDDA
  Top 0.254: IC1.9 15.7,42.9 14.85,42.9 14.31,43.44 C6.1 14.27,44.01 | 14.27,44.01 C7.1 12.42,46.07 11.7,45.35 L1.1 | 14.27,44.01 14.27,43.99
VDDIO
  Top 0.254: IC3.19 14.82,13.97 15.2,14.35 15.2,16.07 | 13.53,14.96 13.53,15.57 14.03,16.07 15.2,16.07 | 15.2,16.07 16.93,16.07 18.73,17.88 IC3.4 18.73,21.98 C18.1
  Top 0.305: 13.53,14.96 IC3.17 | IC3.4 18.75,19.98
VOLTAGE  (via drill 0.6 pad 0.25)
  Top 0.254: IC1.19 10.75,37.3 v10.65,37.2 | v13.3,29.3 13.3,26.35 14.55,25.1 20.25,25.1 22.6,22.75 R25.1
  Bottom 0.254: v13.3,29.3 10.2,29.3 9.9,29.6 9.9,36.45 v10.65,37.2

### Text on the board
Top: QuadVolucer